# EAGLE design Virtual Boy (EAGLE 9.6.2)
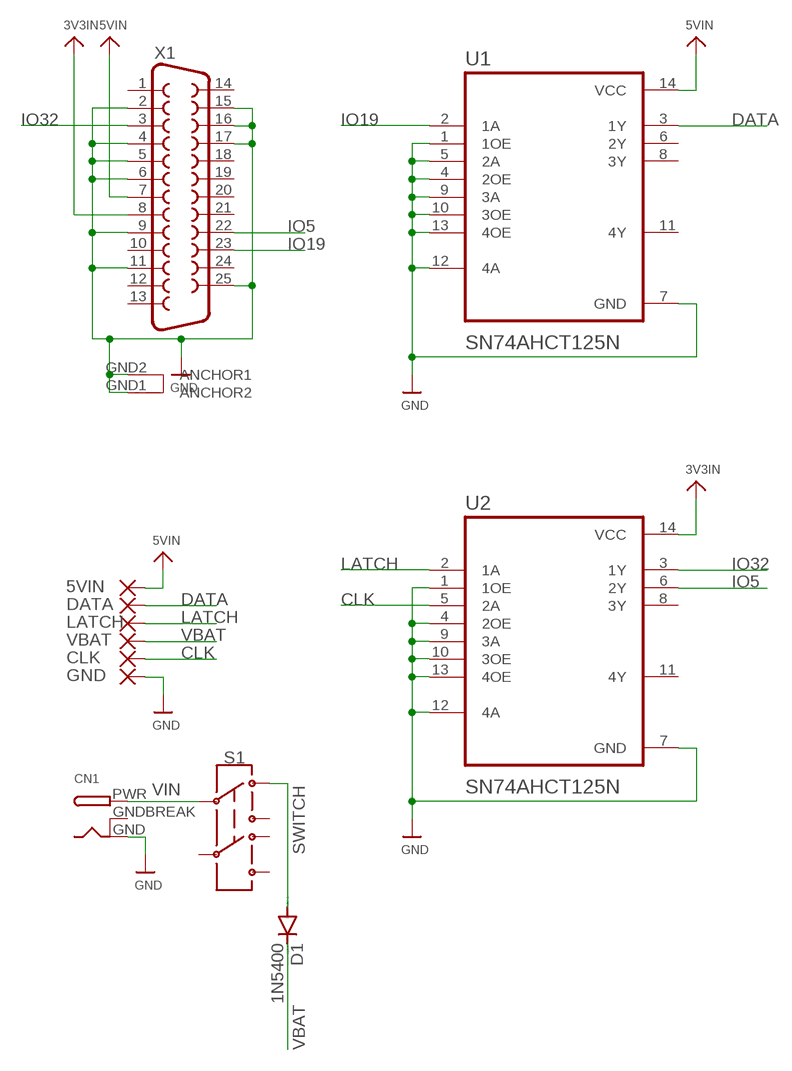
[diagram p0: schematic, sheet 1]

## Parts
5VIN  SMD5  [SMD2,54-5,08]
CLK  SMD5  [SMD2,54-5,08]
CN1  DCBARRELPTH  [DCJACK_2MM_PTH]
D1  1N5400  [DO201-15]
DATA  SMD5  [SMD2,54-5,08]
GND  SMD5  [SMD2,54-5,08]
LATCH  SMD5  [SMD2,54-5,08]
S1  SWITCH-DPDT-PTH-GPI-152-3013  [SWITCH_DPDT_PTH_GPI-152-3013]
U1  SN74AHCT125N  [DIP794W45P254L1969H508Q14]
U2  SN74AHCT125N  [DIP794W45P254L1969H508Q14]
VBAT  SMD5  [SMD2,54-5,08]
X1  DB25_FEMALEHP  [F25HP]

## Nets
3V3IN: U2.14(VCC) X1.8
5VIN: 5VIN.1(P) U1.14(VCC) X1.7
CLK: CLK.1(P) U2.5(2A)
DATA: DATA.1(P) U1.3(1Y)
GND: CN1.GND GND.1(P) U1.1(1OE) U1.4(2OE) U1.5(2A) U1.7(GND) U1.9(3A) U1.10(3OE) U1.12(4A) U1.13(4OE) U2.1(1OE) U2.4(2OE) U2.7(GND) U2.9(3A) U2.10(3OE) U2.12(4A) U2.13(4OE) X1.2 X1.4 X1.5 X1.6 X1.9 X1.11 X1.15 X1.16 X1.17 X1.25 X1.GND1(ANCHOR2) X1.GND2(ANCHOR1)
IO5: U2.6(2Y) X1.22
IO19: U1.2(1A) X1.23
IO32: U2.3(1Y) X1.3
LATCH: LATCH.1(P) U2.2(1A)
SWITCH: D1.A S1.10
VBAT: D1.C VBAT.1(P)
VIN: CN1.PWR S1.C@1
Unconnected: S1.11 S1.20 S1.21 S1.C@2 U1.6(2Y) U1.8(3Y) U1.11(4Y) U2.8(3Y) U2.11(4Y) X1.1 X1.10 X1.12 X1.13 X1.14 X1.18 X1.19 X1.20 X1.21 X1.24

## Power pins joined to a net without a drawn wire
GNDBREAK: CN1.GNDBREAK

## Library data of the parts
5VIN CLK DATA GND LATCH VBAT = wirepad:SMD5: SMD PAD
CN1 = adafruit:DCBARREL: 2.0mm DC Barrel Jack DCJACK_2MM_PTH - Through Hole Jack (4UConnector: 05537)
D1 = diode:1N5400: DIODE standard rectifier, 3 A, 50 V (Motorola)
S1 = Switch Mod:SWITCH-DPDT: Double-Pole, Double-Throw (DPDT) Switch Double-pole, double-throw switches. Variant Overview PTH-GPI-152-3013 Used on SparkFun Geiger Counter <https://www.sparkfun.com/products/11345> SMD-AY0202 Surface Mount DPDT Switch <https://www.sparkfun.com/products/597> (COM-00597) Used on e.g. LilyPad Arduino USB - ATmega32U4 Board <https://www.sparkfun.com/products/12049>; PROD_ID: SWCH-10554
U1 U2 = SN74AHCT125N:SN74AHCT125N: None Check prices <https://pricing.snapeda.com/parts/SN74AHCT125N/Texas%20Instruments/view-part?ref=eda>; AVAILABILITY: In Stock; DESCRIPTION: Quadruple Bus Buffer Gates With 3-State Outputs 14-PDIP -40 to 125; MF: Texas Instruments; MP: SN74AHCT125N; PACKAGE: PDIP-14 Texas Instruments; PRICE: None; PURCHASE-URL: https://pricing.snapeda.com/search/part/SN74AHCT125N/?ref=eda
X1 = SparkFun-Retired:DB25_FEMALE: 25 Pin male connector. PCB edge mount for regular PCB thicknesses. This connector will connect directly to the back of a PC parallel port or through a normal DB25 extension cable (M/F). SKU: PRT-08287

## Board
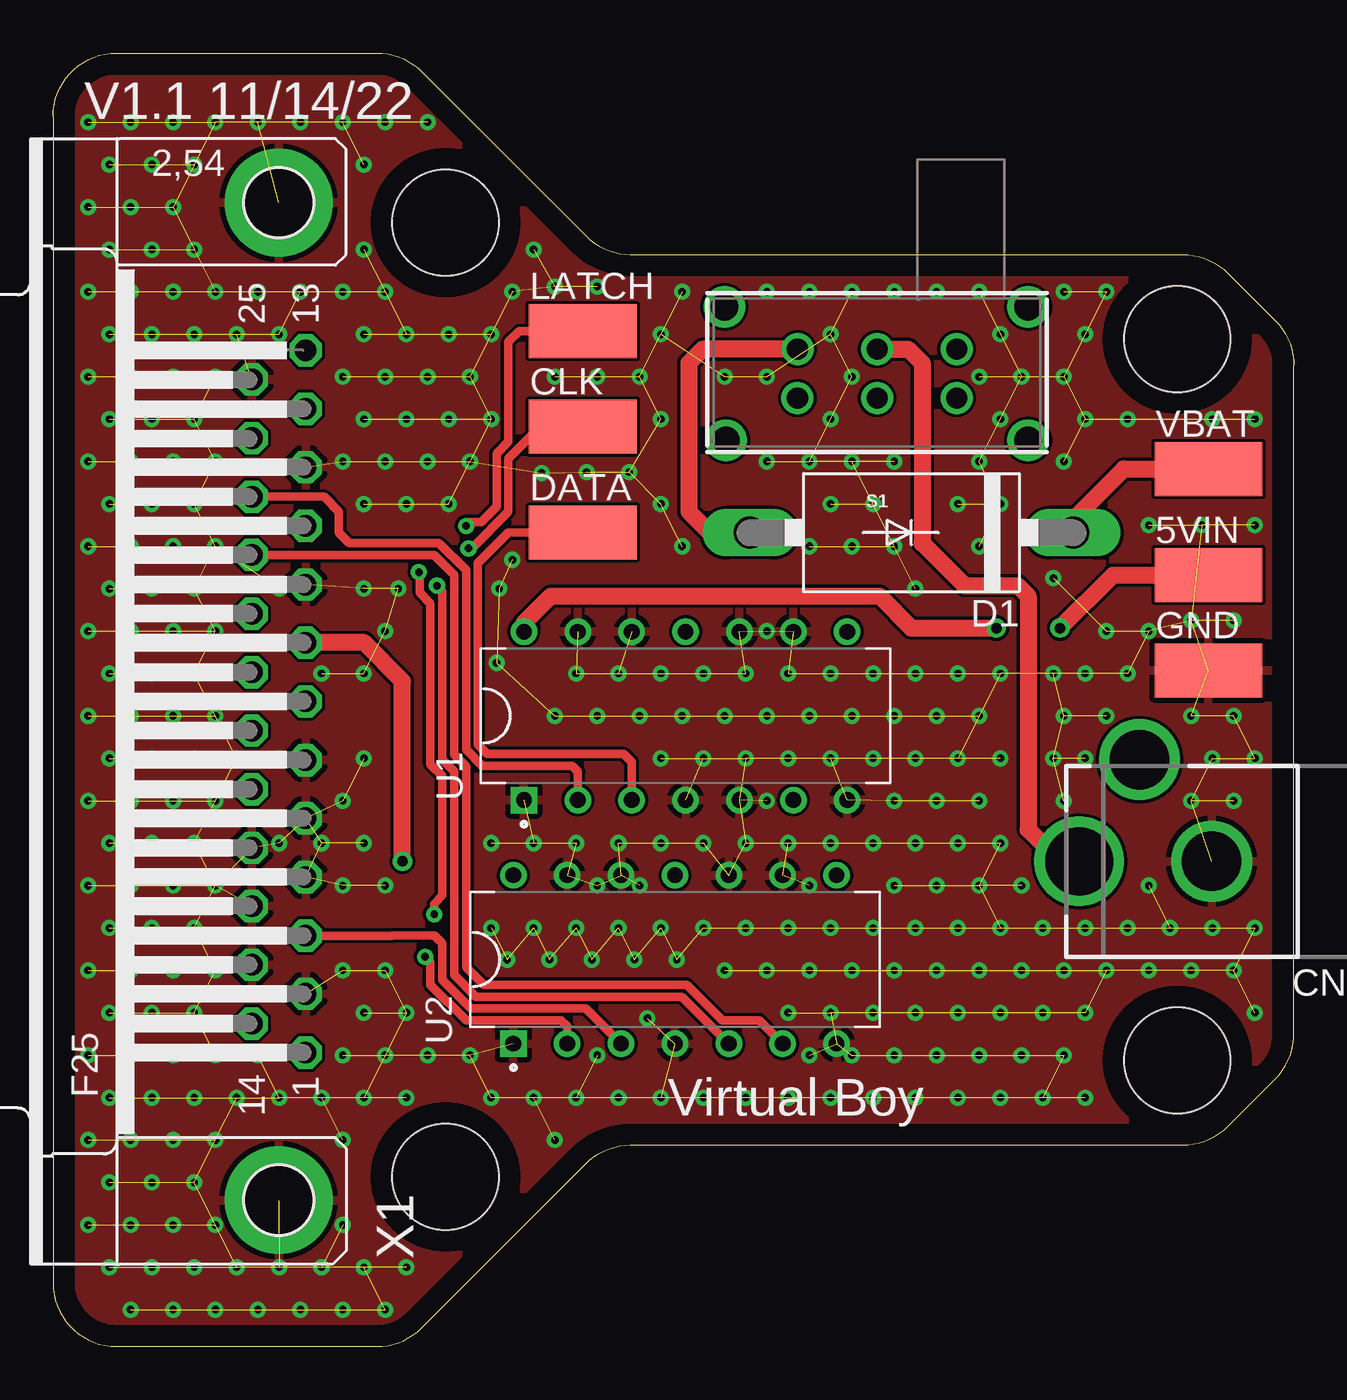
[diagram p1: board, top side]
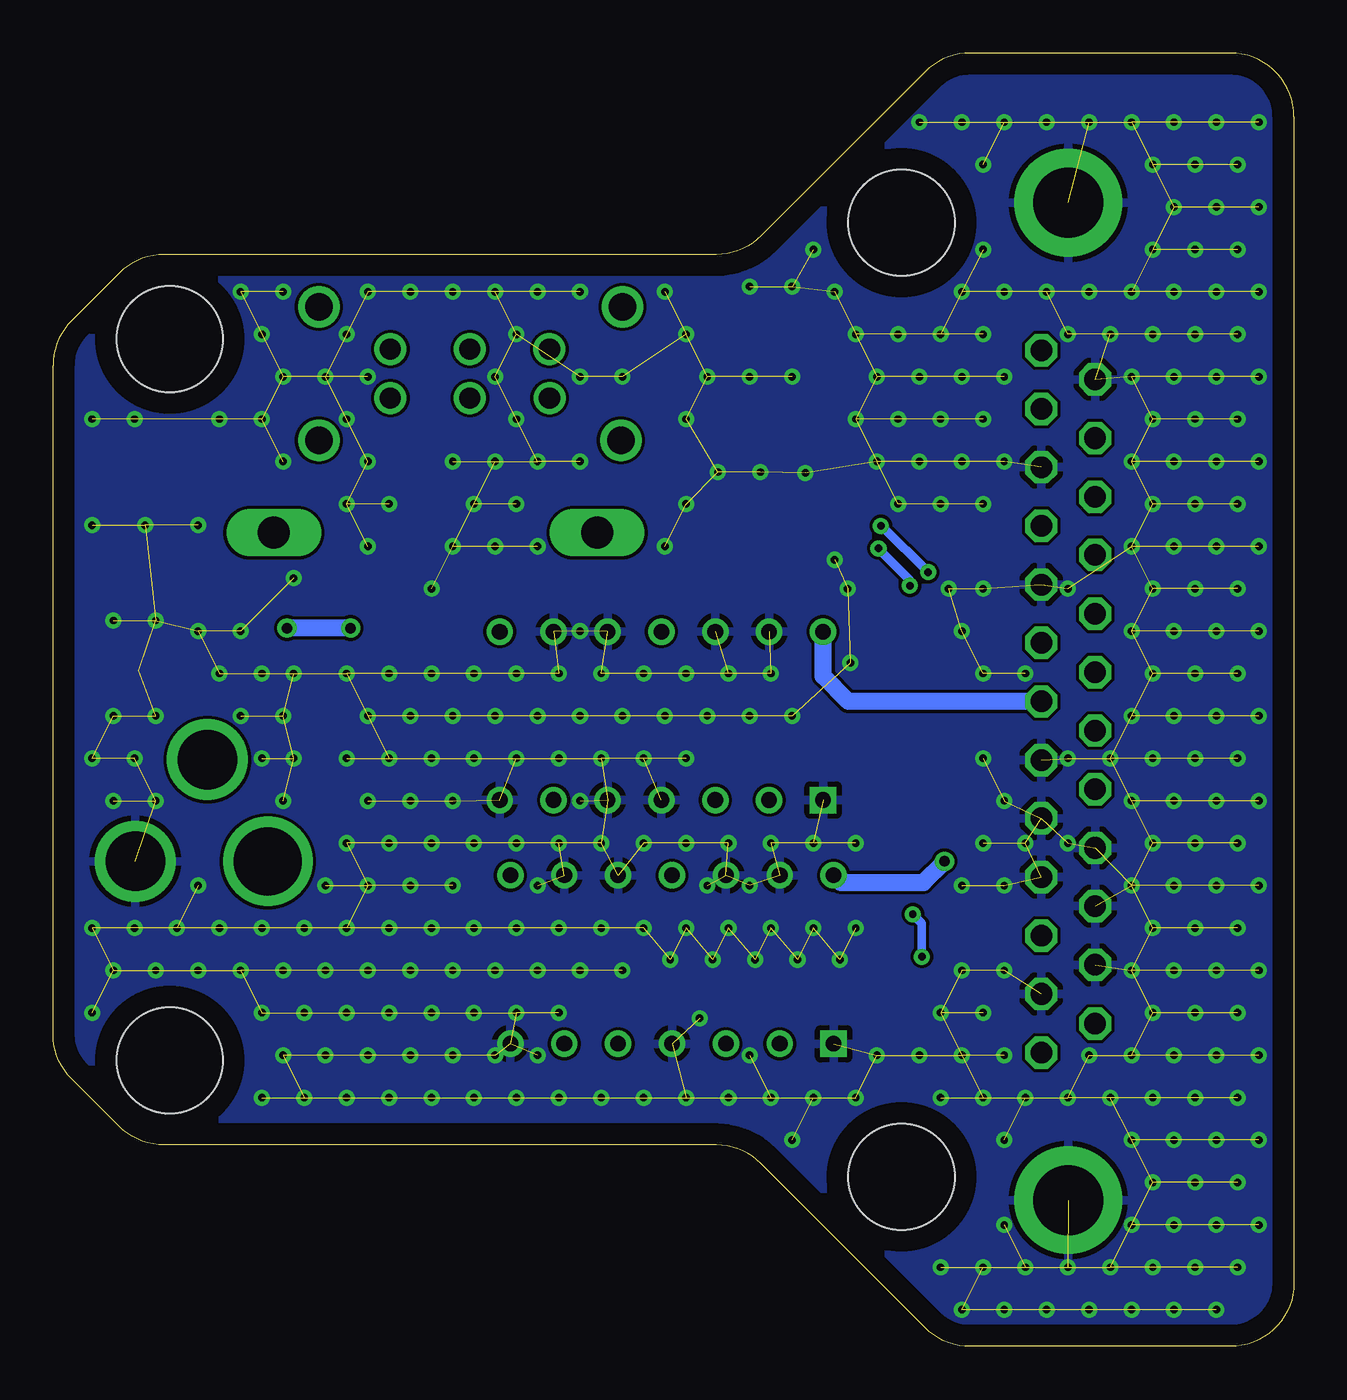
[diagram p2: board, bottom side, seen from below]

Size 58.5 x 61 mm. Coordinates in mm from the lower left corner, seen from the top.
Outline: 0,58 0,3 arc90 3,0 15.26,0 arc45 17.38,0.88 25.12,8.62 arc-45 27.24,9.5 53.26,9.5 arc45 55.38,10.38 57.62,12.62 arc45 58.5,14.74 58.5,46.26 arc45 57.62,48.38 55.38,50.62 arc45 53.26,51.5 27.24,51.5 arc-45 25.12,52.38 17.38,60.12 arc45 15.26,61 3,61 arc90 0,58
Copper layers (1*16): Top 0.035mm / dielectric 1.5mm / Bottom 0.035mm
Design rules "default": minimum track width 6mil, minimum drill 0.35mm, track to track 6mil, track to pad 6mil, pad to pad 6mil, via to via 6mil, smd to smd 6mil, copper to edge 40mil, drill to drill 6mil, minimum pad ring 10mil, minimum via ring 8mil, stop-mask expansion 4mil, vias tented up to drill 0.5mm, thermal gap 10mil
Holes 5 mm at 53,13.5 53,47.5 18.5,53 18.5,8

### Footprints (pad centres in the part's own frame; a part is rotated, then mirrored left to right if it is on the bottom)
SMD2,54-5,08 = smd 2.54 x 5.08: 1 0,0
DCJACK_2MM_PTH = drill 2.8: GND 0,7.35; GNDBREAK 4.8,10.75 | drill 3.2: PWR 0,13.6
DO201-15 = drill 1.499 long: A 7.62,0; C -7.62,0
SWITCH_DPDT_PTH_GPI-152-3013 = drill 1: 10 -3.75,1.155; 11 -3.756,-1.155; 20 3.75,1.155; 21 3.75,-1.155; C@1 0,1.155; C@2 0,-1.155 | drill 1.3: P$7 7.12,3.15; P$8 -7.2,3.15; P$9 -7.12,-3.15; P$10 7.12,-3.15
DIP794W45P254L1969H508Q14 = drill 0.74 pad 1.14 square: 1 -3.97,7.62 | drill 0.74 pad 1.14: 2 -3.97,5.08; 3 -3.97,2.54; 4 -3.97,0; 5 -3.97,-2.54; 6 -3.97,-5.08; 7 -3.97,-7.62; 8 3.97,-7.62; 9 3.97,-5.08; 10 3.97,-2.54; 11 3.97,0; 12 3.97,2.54; 13 3.97,5.08; 14 3.97,7.62
F25HP = drill 1.016 octagon: 1 -16.561,-1.27; 2 -13.792,-1.27; 3 -11.049,-1.27; 4 -8.28,-1.27; 5 -5.512,-1.27; 6 -2.769,-1.27; 7 0,-1.27; 8 2.769,-1.27; 9 5.512,-1.27; 10 8.28,-1.27; 11 11.049,-1.27; 12 13.792,-1.27; 13 16.561,-1.27; 14 -15.189,1.27; 15 -12.421,1.27; 16 -9.652,1.27; 17 -6.909,1.27; 18 -4.14,1.27; 19 -1.372,1.27; 20 1.372,1.27; 21 4.14,1.27; 22 6.909,1.27; 23 9.652,1.27; 24 12.421,1.27; 25 15.189,1.27 | drill 3.302 pad 5.08: GND1 -23.52,0; GND2 23.52,0

### Placement (x,y rotation side)
5VIN  54.47,36.38 270 top
CLK  24.97,43.38 270 top
CN1  61.97,22.88 90 top
D1  40.47,38.38 180 top
DATA  24.97,38.38 270 top
GND  54.47,31.88 270 top
LATCH  24.97,47.88 270 top
S1  38.85,45.88 0 top
U1  29.82,29.74 90 top
U2  29.32,18.25 90 top
VBAT  54.47,41.38 270 top
X1  10.64,30.42 90 top

### Tracks (layer width: path | path; a pad name or v marks a point on that pad's centre or on a via)
3V3IN  (via drill 0.5)
  Top 0.813: v16.47,22.88 16.47,31.38 14.66,33.19 X1.8
  Bottom 0.813: U2.14 21.36,21.88 17.47,21.88 v16.47,22.88
5VIN  (via drill 0.5)
  Top 0.813: U1.14 22.2,34.11 23.47,35.38 38.97,35.38 40.47,33.88 v44.47,33.88 | v47.47,33.88 49.97,36.38 5VIN.1
  Bottom 0.813: v44.47,33.88 v47.47,33.88 | X1.7 21.01,30.42 22.2,31.61 U1.14
CLK  (via drill 0.35)
  Top 0.406: U2.5 29.64,16.5 19.93,16.5 18.91,17.52 18.91,27.13 18.35,27.69 18.35,35.63 v18.1,35.88 | v19.59,37.64 19.73,37.64 21.47,39.38 21.47,41.88 22.97,43.38 CLK.1
  Bottom 0.406: v18.1,35.88 18.1,36.16 v19.59,37.64
DATA
  Top 0.406: U1.3 27.28,27.57 26.91,27.94 20.47,27.94 20.03,28.38 20.03,36.94 21.47,38.38 DATA.1
GND  (via drill 0.35)  (406 unrouted)
  other vias: 1.66,5.74 1.66,9.74 1.66,13.74 1.66,17.74 1.66,21.74 1.66,25.74 1.66,29.74 1.66,33.74 1.66,37.74 1.66,41.74 1.66,45.74 1.66,49.74 1.66,53.74 1.66,57.74 3.66,1.74 2.66,3.74 3.66,5.74 2.66,7.74 3.66,9.74 2.66,11.74 3.66,13.74 2.66,15.74 3.66,17.74 2.66,19.74 3.66,21.74 2.66,23.74 3.66,25.74 2.66,27.74 3.66,29.74 2.66,31.74 3.66,33.74 2.66,35.74 3.66,37.74 2.66,39.74 3.66,41.74 2.66,43.74 3.66,45.74 2.66,47.74 3.66,49.74 2.66,51.74 3.66,53.74 2.66,55.74 3.66,57.74 5.66,1.74 4.66,3.74 5.66,5.74 4.66,7.74 5.66,9.74 4.66,11.74 5.66,13.74 4.66,15.74 5.66,17.74 4.66,19.74 5.66,21.74 4.66,23.74 5.66,25.74 4.66,27.74 5.66,29.74 4.66,31.74 5.66,33.74 4.66,35.74 5.66,37.74 4.66,39.74 5.66,41.74 4.66,43.74 5.66,45.74 4.66,47.74 5.66,49.74 4.66,51.74 5.66,53.74 4.66,55.74 5.66,57.74 7.66,1.74 6.66,3.74 7.66,5.74 6.66,7.74 7.66,9.74 6.66,11.74 7.66,13.74 6.66,15.74 7.66,17.74 6.66,19.74 7.66,21.74 6.66,23.74 7.66,25.74 6.66,27.74 7.66,29.74 6.66,31.74 7.66,33.74 6.66,35.74 7.66,37.74 6.66,39.74 7.66,41.74 6.66,43.74 7.66,45.74 6.66,47.74 7.66,49.74 6.66,51.74 6.66,55.74 7.66,57.74 9.66,1.74 8.66,3.74 8.66,11.74 9.66,13.74 8.66,27.74 8.66,47.74 9.66,49.74 9.66,57.74 11.66,1.74 10.66,3.74 10.66,11.74 10.66,23.74 10.66,27.74 10.66,35.74 10.66,47.74 11.66,49.74 11.66,57.74 13.66,1.74 12.66,3.74 13.66,5.74 13.66,9.74 12.66,11.74 13.66,13.74 13.66,17.74 13.66,21.74 12.66,23.74 13.66,25.74 12.66,31.74 13.66,41.74 13.66,45.74 13.66,49.74 13.66,57.74 15.66,1.74 14.66,3.74 14.66,11.74 15.66,13.74 14.66,15.74 15.66,17.74 15.66,21.74 14.66,23.74 14.66,27.74 14.66,31.74 15.66,33.74 14.66,35.74 14.66,39.74 15.66,41.74 14.66,43.74 15.66,45.74 14.66,47.74 15.66,49.74 14.66,51.74 14.66,55.74 15.66,57.74 16.66,3.74 16.66,11.74 17.66,13.74 16.66,15.74 16.28,35.74 16.66,39.74 17.66,41.74 16.66,43.74 17.66,45.74 16.66,47.74 17.66,57.74 19.66,13.74 18.66,39.74 19.66,41.74 18.66,43.74 19.66,45.74 18.66,47.74 20.66,11.74 21.4,18.24 20.66,19.74 20.66,23.74 20.91,32.24 21.04,35.74 21.66,37.1 20.66,43.74 20.66,47.74 21.66,49.74 23.66,9.74 22.66,11.74 23.4,18.24 22.66,19.74 22.66,23.74 23.66,29.74 23.03,41.2 23.66,45.74 23.66,49.99 22.66,51.74 24.66,11.74 25.66,13.74 25.4,18.24 24.66,19.74 25.66,21.74 24.66,23.74 25.66,29.74 24.66,31.74 25.16,41.24 25.66,45.74 25.66,49.99 26.66,11.74 27.4,18.24 26.66,19.74 27.66,21.74 26.66,23.74 27.66,29.74 26.66,31.74 27.16,41.24 27.66,45.74 28.66,11.74 28.02,15.48 29.4,18.24 28.66,19.74 28.66,23.74 28.66,27.74 29.66,29.74 28.66,31.74 29.66,37.74 28.66,39.74 28.66,43.74 28.66,47.74 29.66,49.74 30.66,11.74 31.66,17.74 30.66,19.74 30.66,23.74 30.66,27.74 31.66,29.74 30.66,31.74 31.66,45.74 32.66,11.74 33.66,17.74 32.66,19.74 32.66,23.74 33.66,25.74 32.66,27.74 33.66,29.74 32.66,31.74 33.66,33.74 33.66,41.74 33.66,45.74 33.66,49.74 34.66,11.74 35.66,13.74 34.66,15.74 35.66,17.74 34.66,19.74 35.66,21.74 34.66,23.74 34.66,27.74 35.66,29.74 34.66,31.74 35.66,37.74 35.66,41.74 35.66,49.74 36.66,11.74 37.66,13.74 36.66,15.74 37.66,17.74 36.66,19.74 36.66,23.74 36.66,27.74 37.66,29.74 36.66,31.74 37.66,37.74 36.66,39.74 37.66,41.74 36.66,43.74 37.66,45.74 36.66,47.74 37.66,49.74 38.66,11.74 39.66,13.74 38.66,15.74 39.66,17.74 38.66,19.74 39.66,21.74 38.66,23.74 39.66,25.74 38.66,27.74 39.66,29.74 38.66,31.74 39.66,37.74 38.66,39.74 39.66,41.74 39.66,49.74 40.66,11.74 41.66,13.74 40.66,15.74 41.66,17.74 40.66,19.74 41.66,21.74 40.66,23.74 41.66,25.74 40.66,27.74 41.66,29.74 40.66,31.74 40.66,35.74 41.66,49.74 42.66,11.74 43.66,13.74 42.66,15.74 43.66,17.74 42.66,19.74 43.66,21.74 42.66,23.74 43.66,25.74 42.66,27.74 43.66,29.74 42.66,31.74 43.66,37.74 42.66,39.74 43.66,41.74 43.66,45.74 43.66,49.74 44.66,11.74 45.66,13.74 44.66,15.74 45.66,17.74 44.66,19.74 45.66,21.74 44.66,23.74 44.66,27.74 44.66,31.74 44.66,39.74 44.66,43.74 45.66,45.74 44.66,47.74 46.66,11.74 47.66,13.74 46.66,15.74 47.66,17.74 46.66,19.74 47.66,25.74 47.16,27.74 47.66,29.74 47.16,31.74 47.16,36.24 47.66,41.74 47.66,45.74 47.66,49.74 48.66,11.74 48.66,15.74 49.66,17.74 48.66,19.74 48.66,27.74 49.66,29.74 48.66,31.74 49.66,33.74 51.66,38.74 48.66,43.74 56.66,38.74 48.66,47.74 49.66,49.74 51.66,17.74 50.66,19.74 51.66,21.74 50.66,31.74 51.66,33.74 50.66,43.74 53.66,17.74 52.66,19.74 53.66,25.74 53.66,29.74 53.66,34.24 54.16,38.74 55.66,17.74 54.66,19.74 55.66,25.74 54.66,27.74 55.66,29.74 55.66,34.24 54.66,43.74 56.66,15.74 56.66,19.74 56.66,27.74 56.66,43.74
  pour Bottom: 0,0 0,61 28.5,61 28.5,51.5 59,51.5 59,9.5 28,9.5 28,0
  pour Top: 0,0 0,61 28.5,61 28.5,51.5 59,51.5 59,9.5 28,9.5 28,0
IO5
  Top 0.406: U2.6 33.3,15.38 31.55,15.38 29.87,17.06 20.47,17.06 20.29,17.06 19.47,17.88 19.47,27.36 18.91,27.92 18.91,36.38 17.96,37.33 X1.22
IO19
  Top 0.406: U1.2 24.74,27.11 24.47,27.38 20.24,27.38 19.47,28.15 19.47,36.61 18.19,37.89 13.97,37.89 13.47,38.39 13.47,39.38 12.78,40.07 X1.23
IO32
  Top 0.406: U2.3 25.12,15.94 19.7,15.94 18.35,17.29 18.35,19 17.97,19.38 15.99,19.38 15.98,19.37 X1.3
LATCH  (via drill 0.35)
  Top 0.406: U2.2 24.24,15.11 23.97,15.38 19.47,15.38 17.79,17.06 17.79,18.13 v17.54,18.38 | v17.97,20.38 17.97,20.88 18.35,21.26 18.35,26.89 17.79,27.45 17.79,35.05 17.29,35.55 17.29,36.47 v17.24,36.52 | v19.47,38.7 19.65,38.88 20.18,38.88 20.91,39.61 20.91,42.11 21.47,42.67 21.47,47.38 21.97,47.88 LATCH.1
  Bottom 0.406: v17.54,18.38 17.54,19.95 v17.97,20.38 | v17.24,36.52 19.42,38.7 v19.47,38.7
SWITCH
  Top 0.813: S1.10 30.62,47.04 29.97,46.38 29.97,39.38 30.97,38.38 D1.A
VBAT
  Top 0.813: D1.C 48.09,39 50.47,41.38 VBAT.1
VIN
  Top 0.813: S1.C@1 40.31,47.04 40.97,46.38 40.97,37.88 42.97,35.88 45.47,35.88 45.97,35.38 45.97,24.38 47.47,22.88 CN1.PWR

### Text on the board
tPlace: Virtual Boy
tNames: V1.1 11/14/22